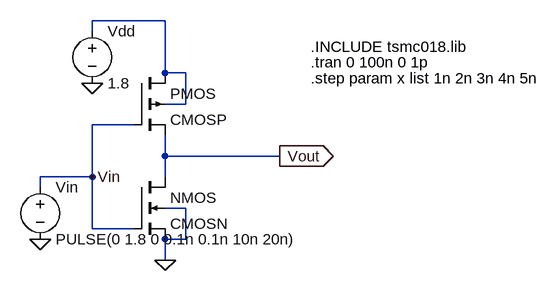
[diagram p0: schematic intrinsic-delay.asc]
intrinsic-delay.asc, the LTspice schematic file:
Version 4
SHEET 1 984 680
WIRE 384 80 272 80
WIRE 272 96 272 80
WIRE 384 160 384 80
WIRE 416 160 384 160
WIRE 416 208 416 160
WIRE 416 208 384 208
WIRE 336 240 272 240
WIRE 384 288 384 256
WIRE 560 288 384 288
WIRE 272 320 272 240
WIRE 272 320 192 320
WIRE 384 320 384 288
WIRE 192 336 192 320
WIRE 416 368 384 368
WIRE 272 400 272 320
WIRE 336 400 272 400
WIRE 416 416 416 368
WIRE 416 416 384 416
WIRE 384 448 384 416
FLAG 384 448 0
FLAG 272 176 0
FLAG 192 416 0
FLAG 560 288 Vout
IOPIN 560 288 Out
FLAG 272 320 Vin
SYMBOL cmosn 336 320 R0
SYMATTR InstName NMOS
SYMATTR Value2 l=180n w={360*x}
SYMBOL cmosp 336 160 R0
SYMATTR InstName PMOS
SYMATTR Value2 l=180n w={360 * x}
SYMBOL Voltage 272 80 R0
WINDOW 0 24 16 Left 0
WINDOW 3 24 96 Left 0
SYMATTR InstName Vdd
SYMATTR Value 1.8
SYMBOL Voltage 192 320 R0
WINDOW 0 24 16 Left 0
WINDOW 3 24 96 Left 0
SYMATTR InstName Vin
SYMATTR Value PULSE(0 1.8 0 0.1n 0.1n 10n 20n)
TEXT 608 120 Left 0 !.INCLUDE tsmc018.lib
TEXT 608 144 Left 0 !.tran 0 100n 0 1p
TEXT 608 168 Left 0 !.step param x list 1n 2n 3n 4n 5n

The netlist it stands for:
* intrinsic-delay.asc
M§NMOS Vout Vin 0 0 CMOSN l=180n w={360*x}
M§PMOS N001 Vin Vout N001 CMOSP l=180n w={360 * x}
Vdd N001 0 1.8
Vin Vin 0 PULSE(0 1.8 0 0.1n 0.1n 10n 20n)
.model NMOS NMOS
.model PMOS PMOS
.lib standard.mos
.INCLUDE tsmc018.lib
.tran 0 100n 0 1p
.step param x list 1n 2n 3n 4n 5n
.backanno
.end